# EAGLE board zumo_tb_03 (EAGLE 9.6.2), part 1 of 3
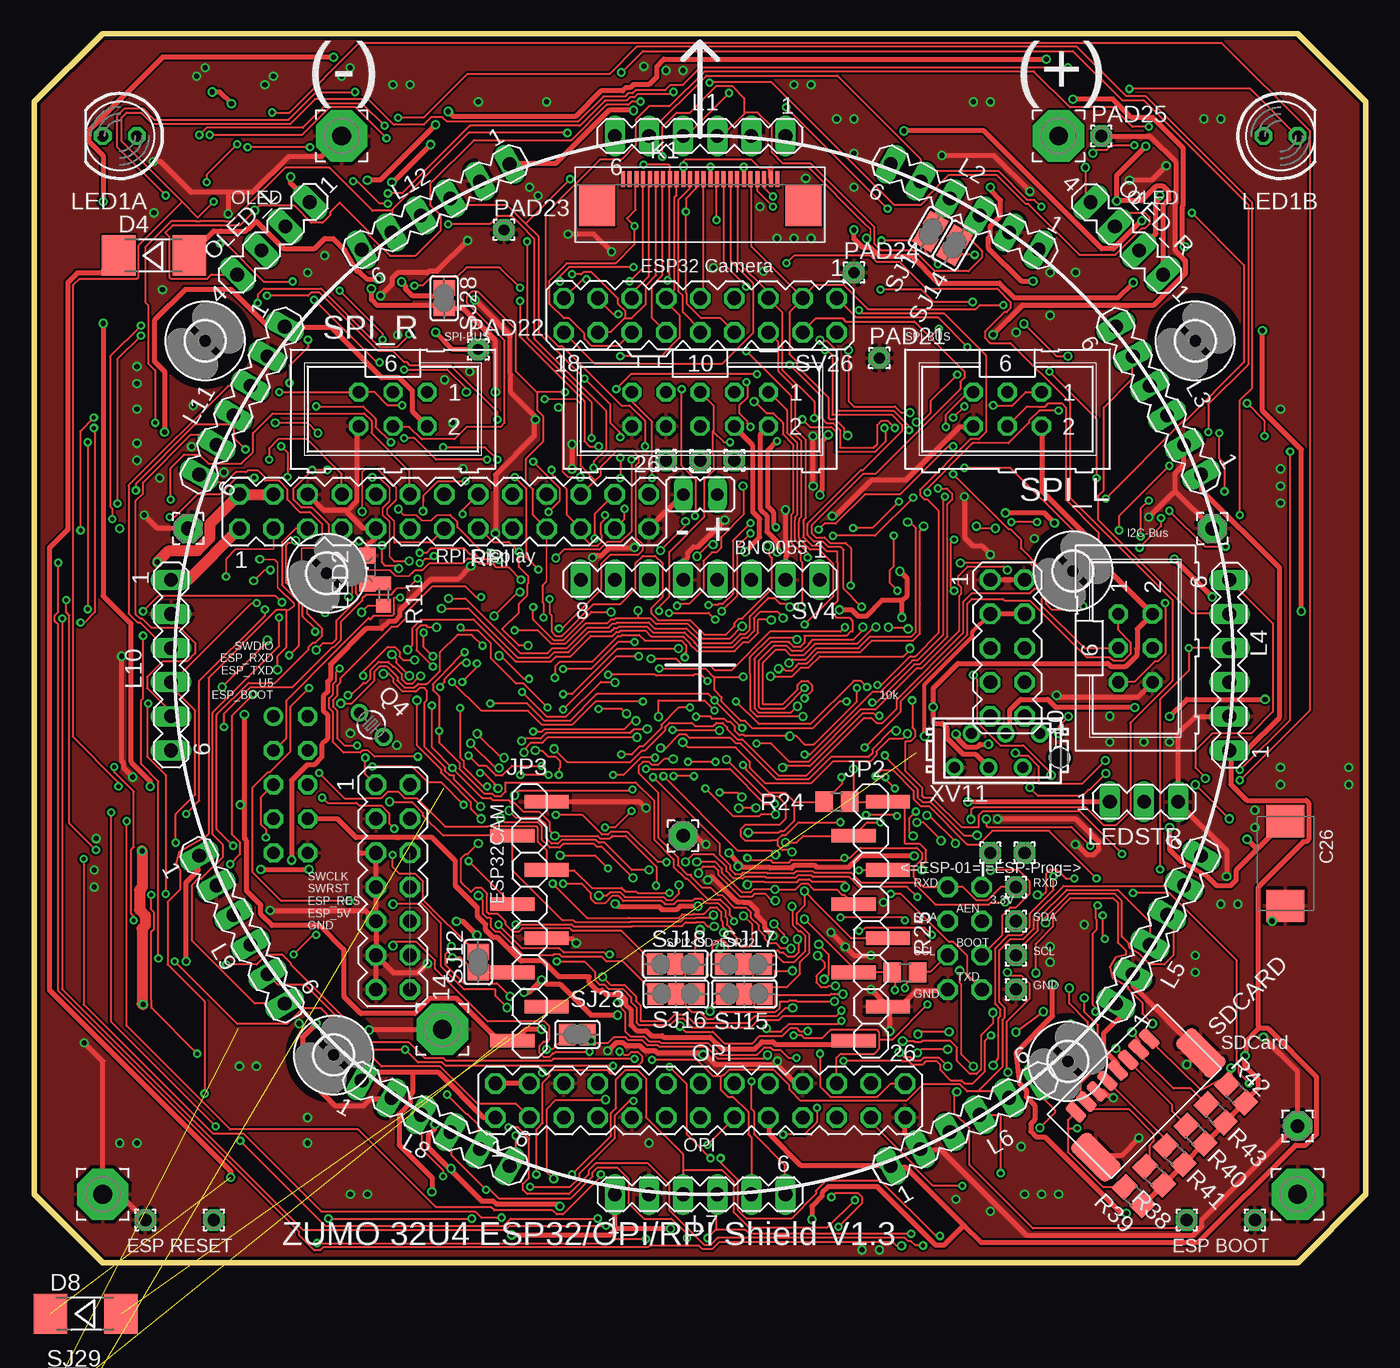
[diagram p2: board, top side]
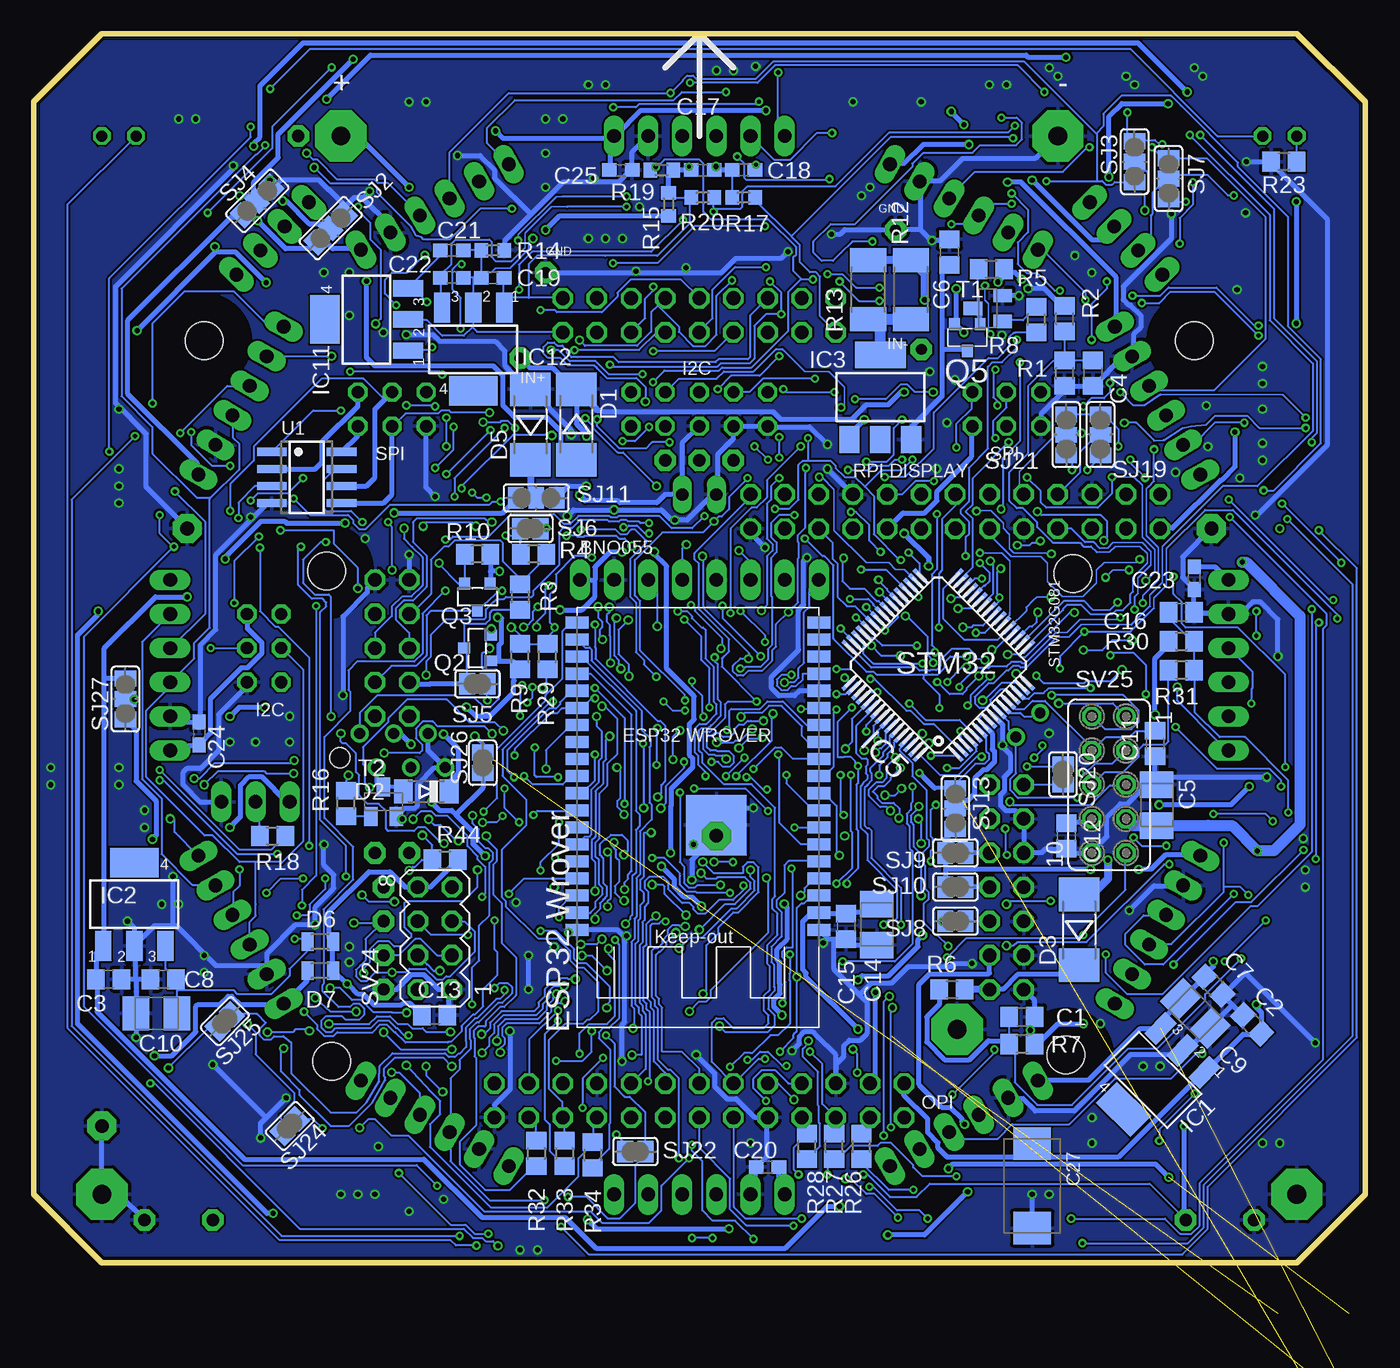
[diagram p3: board, bottom side, seen from below]

Size 99.06 x 91.44 mm. Coordinates in mm from the lower left corner, seen from the top.
Outline: 0,5.08 5.08,0 93.98,0 99.06,5.08 99.06,86.36 93.98,91.44 5.08,91.44 0,86.36 0,5.08
Copper layers (1*16): Top 0.035mm / dielectric 1.5mm / Bottom 0.035mm
Design rules "eagle": minimum track width 5mil, minimum drill 12mil, track to track 6mil, track to pad 6mil, pad to pad 6mil, via to via 6mil, smd to smd 0mil, copper to edge 10mil, drill to drill 10mil, minimum pad ring 10mil, minimum via ring 6mil, stop-mask expansion 2mil, vias tented up to drill 25mil, thermal gap 10mil
Net classes: 1 gnd: width 0.381 mm, drill 0.381 mm; 2 power: width 0.381 mm, drill 0.381 mm
Milling: 8 lines

## Footprints (pad centres in the part's own frame; a part is rotated, then mirrored left to right if it is on the bottom)
3,81/1,4 = drill 1.397 pad 3.81 octagon: 1 0,0
JP1 = drill 0.914 long: 1 0,-1.27; 2 0,1.27
ML6 = drill 0.914 octagon: 1 -2.54,-1.27; 2 -2.54,1.27; 3 0,-1.27; 4 0,1.27; 5 2.54,-1.27; 6 2.54,1.27
ML10 = drill 0.914 octagon: 1 -5.08,-1.27; 2 -5.08,1.27; 3 -2.54,-1.27; 4 -2.54,1.27; 5 0,-1.27; 6 0,1.27; 7 2.54,-1.27; 8 2.54,1.27; 9 5.08,-1.27; 10 5.08,1.27
C0805 = smd 1.3 x 1.5: 1 -0.95,0; 2 0.95,0
B/3528-21R = smd 1.95 x 2.5: + 1.525,0; - -1.525,0
C0603 = smd 1.1 x 1: 1 -0.85,0; 2 0.85,0
SMC_D = smd 2.4 x 2.8: + -3.15,0; - 3.15,0
MELF-MLL41 = smd 2.5 x 3: A 2.625,0; C -2.625,0
MINIMELF = smd 1.4 x 1.8: A 1.7,0; C -1.7,0
MICROMELF-W = smd 0.9 x 1.4: A 0.95,0; C -0.95,0
2,8 = hole 2.8: 0,0
SOT223 = smd 1.219 x 2.235: 1 -2.311,-3.099; 2 0,-3.099; 3 2.311,-3.099 | smd 3.6 x 2.2: 4 0,3.099
SOT223' = smd 1.5 x 2: 1 -2.3,-3.15; 2 0,-3.15; 3 2.3,-3.15 | smd 3.8 x 2: 4 0,3.15
TQFP64 = smd 1.2 x 0.3: 1 -5.7,3.75; 2 -5.7,3.25; 3 -5.7,2.75; 4 -5.7,2.25; 5 -5.7,1.75; 6 -5.7,1.25; 7 -5.7,0.75; 8 -5.7,0.25; 9 -5.7,-0.25; 10 -5.7,-0.75; 11 -5.7,-1.25; 12 -5.7,-1.75; 13 -5.7,-2.25; 14 -5.7,-2.75; 15 -5.7,-3.25; 16 -5.7,-3.75; 33 5.7,-3.75; 34 5.7,-3.25; 35 5.7,-2.75; 36 5.7,-2.25; 37 5.7,-1.75; 38 5.7,-1.25; 39 5.7,-0.75; 40 5.7,-0.25; 41 5.7,0.25; 42 5.7,0.75; 43 5.7,1.25; 44 5.7,1.75; 45 5.7,2.25; 46 5.7,2.75; 47 5.7,3.25; 48 5.7,3.75 | smd 0.3 x 1.2: 17 -3.75,-5.7; 18 -3.25,-5.7; 19 -2.75,-5.7; 20 -2.25,-5.7; 21 -1.75,-5.7; 22 -1.25,-5.7; 23 -0.75,-5.7; 24 -0.25,-5.7; 25 0.25,-5.7; 26 0.75,-5.7; 27 1.25,-5.7; 28 1.75,-5.7; 29 2.25,-5.7; 30 2.75,-5.7; 31 3.25,-5.7; 32 3.75,-5.7; 49 3.75,5.7; 50 3.25,5.7; 51 2.75,5.7; 52 2.25,5.7; 53 1.75,5.7; 54 1.25,5.7; 55 0.75,5.7; 56 0.25,5.7; 57 -0.25,5.7; 58 -0.75,5.7; 59 -1.25,5.7; 60 -1.75,5.7; 61 -2.25,5.7; 62 -2.75,5.7; 63 -3.25,5.7; 64 -3.75,5.7
ESP32-WROVER = smd 1.7 x 0.9: CLK 18,1.27; CMD 0,1.27; EN 0,21.59; GND 0,24.13; GND3 18,24.13; GND_2 0,6.35; IO0 18,7.62; IO2 18,6.35; IO4 18,8.89; IO5 18,12.7; IO12 0,7.62; IO13 0,5.08; IO14 0,8.89; IO15 18,5.08; IO18 18,13.97; IO19 18,15.24; IO21 18,17.78; IO22 18,21.59; IO23 18,22.86; IO25 0,12.7; IO26 0,11.43; IO27 0,10.16; IO32 0,15.24; IO33 0,13.97; IO34 0,17.78; IO35 0,16.51; NC0 18,16.51; NC1 18,10.16; NC2 18,11.43; RXD0 18,19.05; SD0 18,2.54; SD1 18,3.81; SD2 0,3.81; SD3 0,2.54; SENSOR_VN 0,19.05; SENSOR_VP 0,20.32; TXD0 18,20.32; VDD33 0,22.86 | smd 4.5 x 4.5: GND2 7.62,16.34
1X08SMD = smd 1.016 x 3.302: 1 -1.27,1.27; 2 1.27,-1.27; 3 3.81,1.27; 4 6.35,-1.27; 5 8.89,1.27; 6 11.43,-1.27; 7 13.97,1.27; 8 16.51,-1.27
68712414522 = smd 0.3 x 1.2: 1 -5.75,0.6; 2 -5.25,0.6; 3 -4.75,0.6; 4 -4.25,0.6; 5 -3.75,0.6; 6 -3.25,0.6; 7 -2.75,0.6; 8 -2.25,0.6; 9 -1.75,0.6; 10 -1.25,0.6; 11 -0.75,0.6; 12 -0.25,0.6; 13 0.25,0.6; 14 0.75,0.6; 15 1.25,0.6; 16 1.75,0.6; 17 2.25,0.6; 18 2.75,0.6; 19 3.25,0.6; 20 3.75,0.6; 21 4.25,0.6; 22 4.75,0.6; 23 5.25,0.6; 24 5.75,0.6 | smd 2.7 x 3: Z1 -7.68,-1.38; Z2 7.68,-1.38
MA06-1 = drill 1.016 long: 1 -6.35,0; 2 -3.81,0; 3 -1.27,0; 4 1.27,0; 5 3.81,0; 6 6.35,0
LED5MM = drill 0.813 octagon: A -1.27,0; K 1.27,0
CHIPLED_0805 = smd 1.2 x 1.2: A 0,-1.05; C 0,1.05
MA03-1 = drill 1.016 long: 1 -2.54,0; 2 0,0; 3 2.54,0
MA04-1 = drill 1.016 long: 1 -3.81,0; 2 -1.27,0; 3 1.27,0; 4 3.81,0
MA13-2 = drill 1.016 octagon: 1 -15.24,-1.27; 2 -15.24,1.27; 3 -12.7,-1.27; 4 -12.7,1.27; 5 -10.16,-1.27; 6 -10.16,1.27; 7 -7.62,-1.27; 8 -7.62,1.27; 9 -5.08,-1.27; 10 -5.08,1.27; 11 -2.54,-1.27; 12 -2.54,1.27; 13 0,-1.27; 14 0,1.27; 15 2.54,-1.27; 16 2.54,1.27; 17 5.08,-1.27; 18 5.08,1.27; 19 7.62,-1.27; 20 7.62,1.27; 21 10.16,-1.27; 22 10.16,1.27; 23 12.7,-1.27; 24 12.7,1.27; 25 15.24,-1.27; 26 15.24,1.27
1,6/0,9 = drill 0.914 pad 1.6 octagon: 1 0,0
2,15/1,0 = drill 1.016 pad 2.159 octagon: 1 0,0
1,6/0,8 = drill 0.813 pad 1.6 octagon: 1 0,0
SOT23 = smd 0.8 x 0.9: 1 -0.95,-1; 2 0.95,-1; 3 0,1
TC26V = drill 0.813: 1 -1.27,0; 2 1.27,0
MICRO3 = smd 0.8 x 0.9: 1 -0.95,-1; 2 0.95,-1; 3 0,1
R0805 = smd 1.3 x 1.5: 1 -0.95,0; 2 0.95,0
R0603 = smd 1 x 1.1: 1 -0.85,0; 2 0.85,0
R2010 = smd 1.8 x 2.7: 1 -2.2,0; 2 2.2,0
47309-3351 = smd 0.8 x 1.6: 1 4.4,5.66; 2 3.3,5.66; 3 2.2,5.66; 4 1.1,5.66; 5 0,5.66; 6 -1.1,5.66; 7 -2.2,5.66; 8 -3.3,5.66 | smd 1.93 x 3.81: G1 -4.61,2.24; G2 6.393,2.217
SJ = smd 1.168 x 1.6: 1 -0.762,0; 2 0.762,0
SJ_2 = smd 1.168 x 1.6: 1 -1.524,0; 2 0,0; 3 1.524,0
MA07-2 = drill 1.016 octagon: 1 -7.62,-1.27; 2 -7.62,1.27; 3 -5.08,-1.27; 4 -5.08,1.27; 5 -2.54,-1.27; 6 -2.54,1.27; 7 0,-1.27; 8 0,1.27; 9 2.54,-1.27; 10 2.54,1.27; 11 5.08,-1.27; 12 5.08,1.27; 13 7.62,-1.27; 14 7.62,1.27
MA08-1 = drill 1.016 long: 1 -8.89,0; 2 -6.35,0; 3 -3.81,0; 4 -1.27,0; 5 1.27,0; 6 3.81,0; 7 6.35,0; 8 8.89,0
MA05-2 = drill 1.016 octagon: 1 -5.08,-1.27; 2 -5.08,1.27; 3 -2.54,-1.27; 4 -2.54,1.27; 5 0,-1.27; 6 0,1.27; 7 2.54,-1.27; 8 2.54,1.27; 9 5.08,-1.27; 10 5.08,1.27
MA04-2 = drill 1.016 octagon: 1 -3.81,-1.27; 2 -3.81,1.27; 3 -1.27,-1.27; 4 -1.27,1.27; 5 1.27,-1.27; 6 1.27,1.27; 7 3.81,-1.27; 8 3.81,1.27
FE05-2 = drill 0.914: 1 -5.08,1.27 | drill 0.914 octagon: 2 -5.08,-1.27; 3 -2.54,1.27; 4 -2.54,-1.27; 5 0,1.27; 6 0,-1.27; 7 2.54,1.27; 8 2.54,-1.27; 9 5.08,1.27; 10 5.08,-1.27
MA09-2 = drill 1.016 octagon: 1 -10.16,-1.27; 2 -10.16,1.27; 3 -7.62,-1.27; 4 -7.62,1.27; 5 -5.08,-1.27; 6 -5.08,1.27; 7 -2.54,-1.27; 8 -2.54,1.27; 9 0,-1.27; 10 0,1.27; 11 2.54,-1.27; 12 2.54,1.27; 13 5.08,-1.27; 14 5.08,1.27; 15 7.62,-1.27; 16 7.62,1.27; 17 10.16,-1.27; 18 10.16,1.27
SOT23-BEC = smd 1 x 1.4: B -0.95,-1.1; C 0,1.1; E 0.95,-1.1
SO08 = smd 0.6 x 2.2: 1 -1.905,-2.6; 2 -0.635,-2.6; 3 0.635,-2.6; 4 1.905,-2.6; 5 1.905,2.6; 6 0.635,2.6; 7 -0.635,2.6; 8 -1.905,2.6
MICROMATCH-6 = drill 0.813: 1 3.175,1.27; 2 1.905,-1.27; 3 0.635,1.27; 4 -0.635,-1.27; 5 -1.905,1.27; 6 -3.175,-1.27 | hole 1.5: 4.63,-0.55

## Placement (x,y rotation side)
(+)  [3,81/1,4]  76.2,83.82 0 top
(-)  [3,81/1,4]  22.86,83.82 0 top
+-  [JP1]  49.53,57.15 270 top
BUS_6  [ML6]  81.92,45.72 270 top
BUS_10  [ML10]  49.53,63.5 180 top
C1  0.1  [C0805]  25.53,18.29 0 bottom
C2  0.1  [C0805]  8.4,17.73 135 bottom
C3  0.1  [C0805]  93.47,21.08 0 bottom
C4  0.1  [C0805]  20.26,66.17 270 bottom
C5  100uF/6V  [B/3528-21R]  15.49,34.04 270 bottom
C6  0.1  [C0805]  30.92,75.18 90 bottom
C7  0.1  [C0805]  11.28,20.6 315 bottom
C8  0.1  [C0805]  89.41,21.08 180 bottom
C9  100uF/6V  [B/3528-21R]  12.62,18.54 135 bottom
C10  100uF/6V  [B/3528-21R]  89.92,18.54 0 bottom
C11  0.1  [C0805]  15.62,38.61 90 bottom
C12  0.1  [C0805]  22.23,31.75 270 bottom
C13  0.1  [C0805]  69.22,18.41 0 bottom
C14  100uF/6V  [B/3528-21R]  36.32,25.15 90 bottom
C15  0.1  [C0805]  38.61,25.02 270 bottom
C16  0.1  [C0805]  13.65,48.39 180 bottom
C17  [C0603]  49.28,81.28 180 bottom
C18  [C0603]  46.23,81.28 0 bottom
C19  [C0603]  64.9,73.28 180 bottom
C20  [C0603]  44.45,7.11 0 bottom
C21  [C0603]  67.94,75.31 180 bottom
C22  [C0603]  67.94,73.28 0 bottom
C23  [C0603]  12.7,50.93 90 bottom
C24  [C0603]  86.74,39.37 270 bottom
C25  [C0603]  55.37,81.28 180 bottom
C26  470uF/10V  [SMC_D]  93.07,29.69 270 top
C27  470uF/10V  [SMC_D]  24.77,5.71 270 bottom
D1  [MELF-MLL41]  58.67,62.36 270 bottom
D2  [MINIMELF]  69.85,35.05 180 bottom
D3  [MELF-MLL41]  21.27,24.77 90 bottom
D4  [MELF-MLL41]  8.89,74.93 0 top
D5  [MELF-MLL41]  62.1,62.36 90 bottom
D6  [MICROMELF-W]  77.72,23.88 180 bottom
D7  [MICROMELF-W]  77.72,21.72 180 bottom
D8  [MELF-MLL41]  3.81,-3.81 0 top  (outside the outline)
H1  MOUNT-HOLE2.8  [2,8]  86.36,68.58 0 top
H2  MOUNT-HOLE2.8  [2,8]  12.7,68.58 0 top
H3  MOUNT-HOLE2.8  [2,8]  76.88,14.97 0 top
H4  MOUNT-HOLE2.8  [2,8]  22.26,15.45 0 top
H5  MOUNT-HOLE2.8  [2,8]  21.74,51.28 0 top
H6  MOUNT-HOLE2.8  [2,8]  77.27,51.45 0 top
IC1  LT 1963 AEST-3.3 (1.5A)  [SOT223]  15.77,13.6 135 bottom
IC2  MCP1703DB  [SOT223]  91.57,26.67 0 bottom
IC3  LM317MBSTT3  [SOT223']  36.07,64.39 0 bottom
IC5  STM32G081RBT6  [TQFP64]  31.75,44.45 135 bottom
IC10  ESP32-WROVER  [ESP32-WROVER]  40.64,48.9 180 bottom
IC11  MCP1703DB  [SOT223]  74.3,70.17 90 bottom
IC12  MCP1703DB  [SOT223]  66.36,67.94 180 bottom
JP2  [1X08SMD]  62.23,33.02 270 top
JP3  [1X08SMD]  36.83,33.02 270 top
K1  68712414522  [68712414522]  49.53,80.01 0 top
L1  [MA06-1]  49.53,83.82 180 top
L2  [MA06-1]  69.22,78.55 150 top
L3  [MA06-1]  83.63,64.14 120 top
L4  [MA06-1]  88.9,44.45 90 top
L5  [MA06-1]  83.63,24.77 60 top
L6  [MA06-1]  69.22,10.35 30 top
L7  [MA06-1]  49.53,5.08 0 top
L8  [MA06-1]  29.84,10.35 330 top
L9  [MA06-1]  15.43,24.77 300 top
L10  [MA06-1]  10.16,44.45 270 top
L11  [MA06-1]  15.43,64.14 240 top
L12  [MA06-1]  29.84,78.55 210 top
LED1A  [LED5MM]  6.35,83.82 180 top
LED1B  [LED5MM]  92.71,83.82 0 top
LED2  [CHIPLED_0805]  24.77,51.56 0 top
LEDSTR  [MA03-1]  82.55,34.29 0 top
OLED_L  [MA04-1]  17.78,76.2 225 top
OLED_R  [MA04-1]  81.28,76.2 135 top
OPI  [MA13-2]  49.53,12.06 0 top
PAD1  [1,6/0,9]  73.03,27.94 0 top
PAD2  [1,6/0,9]  73.03,25.4 0 top
PAD3  [3,81/1,4]  5.08,5.08 0 top
PAD4  [2,15/1,0]  87.63,54.61 0 top
PAD5  [2,15/1,0]  11.43,54.61 0 top
PAD6  [2,15/1,0]  93.98,10.16 0 top
PAD7  [3,81/1,4]  93.98,5.08 0 top
PAD8  [2,15/1,0]  48.26,31.75 0 top
PAD9  [3,81/1,4]  30.35,17.35 0 top
PAD10  [1,6/0,9]  73.03,22.86 0 top
PAD11  [1,6/0,9]  73.03,20.32 0 top
PAD12  [1,6/0,9]  49.53,59.69 0 top
PAD13  [1,6/0,9]  52.07,59.69 0 top
PAD14  [1,6/0,9]  46.99,59.69 0 top
PAD15  [1,6/0,9]  73.66,30.48 0 top
PAD16  [1,6/0,9]  71.12,30.48 0 top
PAD17  [1,6/0,9]  8.26,3.17 0 top
PAD18  [1,6/0,9]  13.34,3.17 0 top
PAD19  [1,6/0,9]  90.81,3.17 0 top
PAD20  [1,6/0,9]  85.72,3.17 0 top
PAD21  [1,6/0,8]  62.87,67.31 0 top
PAD22  [1,6/0,8]  33.02,67.94 0 top
PAD23  [1,6/0,8]  34.92,76.83 0 top
PAD24  [1,6/0,8]  60.96,73.66 0 top
PAD25  [1,6/0,9]  79.38,83.82 0 top
Q2  BSS138  [SOT23]  66.04,45.72 90 bottom
Q3  BSS138  [SOT23]  66.04,49.53 180 bottom
Q4  [TC26V]  25.07,40.01 135 top
Q5  IRLML5203  [MICRO3]  29.59,68.83 180 bottom
R1  22k  [R0805]  22.35,66.17 90 bottom
R2  100k  [R0805]  22.35,70.23 90 bottom
R3  10k  [R0805]  62.87,49.53 270 bottom
R4  10k  [R0805]  61.85,52.7 180 bottom
R5  100k  [R0805]  27.81,73.91 0 bottom
R6  100k  [R0805]  30.73,20.32 0 bottom
R7  22k  [R0805]  25.53,16.26 180 bottom
R8  10k  [R0805]  24.45,70.17 90 bottom
R9  10k  [R0805]  62.87,45.09 90 bottom
R10  10k  [R0805]  66.04,52.7 180 bottom
R11  [R0603]  25.98,49.71 270 top
R12  10  [R2010]  33.78,72.39 90 bottom
R13  10  [R2010]  36.96,72.39 90 bottom
R14  [R0603]  64.9,75.31 180 bottom
R15  [R0603]  51.82,78.74 90 bottom
R16  1k  [R0805]  75.82,34.16 90 bottom
R17  [R0603]  46.23,79.25 180 bottom
R18  470  [R0805]  81.28,31.75 0 bottom
R19  [R0603]  52.32,81.28 180 bottom
R20  [R0603]  49.28,79.25 0 bottom
R23  68  [R0805]  6.03,81.92 180 bottom
R24  -  [R0805]  59.69,34.29 0 top
R25  100  [R0805]  64.77,21.59 0 top
R26  100  [R0805]  37.47,8.64 90 bottom
R27  100  [R0805]  39.5,8.64 90 bottom
R28  100  [R0805]  41.53,8.64 90 bottom
R29  100  [R0805]  60.83,45.09 90 bottom
R30  100k  [R0805]  13.65,46.23 0 bottom
R31  470  [R0805]  13.65,44.07 180 bottom
R32  0  [R0805]  61.66,8.13 270 bottom
R33  0  [R0805]  59.56,8.13 270 bottom
R34  0  [R0805]  57.47,8 270 bottom
R38  10k  [R0805]  83.31,6.48 135 top
R39  10k  [R0805]  81.79,4.95 135 top
R40  10k  [R0805]  86.39,9.53 135 top
R41  10k  [R0805]  84.84,8 135 top
R42  10k  [R0805]  89.41,12.57 135 top
R43  10k  [R0805]  87.88,11.1 135 top
R44  100k  [R0805]  68.45,29.97 0 bottom
RPI  [MA13-2]  30.48,55.88 0 top
SDCARD  47309-3351  [47309-3351]  83.82,9.53 45 top
SJ1  [SJ]  66.67,76.71 60 top
SJ2  [SJ_2]  76.96,76.96 225 bottom
SJ3  [SJ_2]  17.14,81.92 270 bottom
SJ4  [SJ_2]  82.42,78.99 225 bottom
SJ5  [SJ]  66.04,43.05 180 bottom
SJ6  [SJ]  62.1,54.61 180 bottom
SJ7  [SJ_2]  14.61,80.64 90 bottom
SJ8  [SJ]  30.48,25.4 180 bottom
SJ9  [SJ]  30.48,30.48 180 bottom
SJ10  [SJ]  30.48,27.94 180 bottom
SJ11  [SJ_2]  61.66,56.9 0 bottom
SJ12  [SJ]  33.02,22.35 90 top
SJ13  [SJ_2]  30.48,33.78 270 bottom
SJ14  [SJ]  68.45,75.69 60 top
SJ15  J_RXPTXD  [SJ_2]  52.81,19.99 180 top
SJ16  J_RXPTXD  [SJ_2]  47.73,19.99 0 top
SJ17  J_RXPTXD  [SJ_2]  52.76,22.2 180 top
SJ18  J_RXPTXD  [SJ_2]  47.68,22.2 0 top
SJ19  J_RPITXD  [SJ_2]  19.68,61.59 90 bottom
SJ20  [SJ]  22.48,36.32 270 bottom
SJ21  J_RXPTXD  [SJ_2]  22.23,61.59 90 bottom
SJ22  [SJ]  54.29,8.26 180 bottom
SJ23  [SJ]  40.39,16.97 180 top
SJ24  [SJ]  80.01,10.16 225 bottom
SJ25  [SJ]  84.84,17.96 225 bottom
SJ26  [SJ]  65.63,37.19 90 bottom
SJ27  [SJ_2]  92.23,41.94 90 bottom
SJ28  [SJ]  30.48,71.75 270 top
SJ29  [SJ]  2.54,-8.89 0 top  (outside the outline)
SJ30  [SJ]  2.54,-13.34 0 top  (outside the outline)
SPI_L  [ML6]  72.39,63.5 180 top
SPI_R  [ML6]  26.67,63.5 180 top
SV2  [MA07-2]  26.67,27.94 270 top
SV4  BNO055  [MA08-1]  49.53,50.8 180 top
SV7  [MA05-2]  72.39,45.72 270 top
SV24  [MA04-2]  69.22,24.13 90 bottom
SV25  [FE05-2]  19.05,35.56 270 bottom
SV26  [MA09-2]  49.53,70.48 180 top
T1  [SOT23-BEC]  28.07,70.99 90 bottom
T2  [SOT23-BEC]  73.03,34.29 0 bottom
U1  W25Q40BVSN  [SO08]  78.74,58.42 270 bottom
XV11  MICROMATCH-6  [MICROMATCH-6]  71.63,38.1 0 top

## Tracks (layer width: path | path; a pad name or v marks a point on that pad's centre or on a via)
ADC0
  Bottom 0.127: 19.96,52.86 19.02,52.86 18.59,53.29 16.74,53.29 16.2,52.76 16.2,52.05 17.27,50.98 17.27,49.91
  Bottom 0.152: IC5.17 24.99,45.87 24.99,46.02 22.48,48.54 22.48,48.62 22.15,48.95 21.13,48.95 20.45,48.26 18.8,48.26 18.52,48.54 18.01,48.54 17.45,49.1 17.45,49.73 17.27,49.91 | R1.2 22.4,67.06 23.24,67.06 25.07,65.23 25.07,60.2 26.44,58.83 26.44,56.67 25.91,56.13 25.45,56.13 24.38,55.07 24.38,54.71 23.24,53.57 21.23,53.57 20.95,53.29 20.4,53.29 19.96,52.86 | C4.1 20.27,67.13 22.33,67.13 R1.2 | R2.1 22.33,69.27 22.33,67.21 R1.2
ADC1  (via drill 0.3, 0.35)
  Top 0.127: v18.41,49.12 17.93,49.61 17.9,49.61
  Top 0.152: v8.08,48.46 9.22,49.61 17.9,49.61 | v8.08,46.63 8.08,41.99 7.92,41.83 7.92,37.11 9.22,35.81 v9.22,22.63
  Bottom 0.127: 20.93,49.25 20.24,48.56 18.97,48.56 v18.41,49.12
  Bottom 0.152: v8.08,46.63 v8.08,48.46 | v9.22,22.63 11.89,19.96 11.89,19.51 15.47,15.93 17.6,15.93 21.79,11.73 24.38,11.73 26.06,13.41 26.06,15.85 26.44,16.23 R7.2 26.44,16.31 26.44,16.51 26.44,18.29 C1.1 | IC5.18 25.38,46.25 22.38,49.25 20.93,49.25 | R6.1 31.67,20.27
  Bottom 0.381: 31.67,20.27 31.67,19.21 32.6,18.28 32.6,16.42 31.28,15.1 29.42,15.1 28.01,16.51 26.44,16.51
BNO055_RESET  (via drill 0.3, 0.35)
  Top 0.152: v36.27,42.44 38.1,40.62 39.55,40.62 42.14,43.2 43.16,43.2 v43.2,43.16
  Bottom 0.152: v36.27,42.44 36.96,42.44 37.34,42.06 IC5.52 | v43.2,43.16 43.16,43.2 42.45,43.2 42.14,43.52 42.14,44.22 41.73,44.63 41.73,48.4 41.35,48.78 41.35,50.09 SV4.8
BUS_FON  (via drill 0.35)
  Top 0.127: v40.62,58.45 39.7,58.45 39.29,58.85 39.29,63.32 v38.99,63.63
  Bottom 0.127: IC5.34 34.27,51.56 34.92,51.56 35.43,52.07 37.08,52.07 39.5,54.48 39.5,57.53 40.41,58.45 v40.62,58.45 | v38.99,63.63 38.73,63.88 38.73,65.15 39.88,66.29 41.68,66.29
  Bottom 0.152: 41.68,66.29 43.36,67.97 43.81,67.97 45.49,66.29 47.7,66.29 48.23,65.76 51.05,65.76 52.05,64.77 BUS_10.3 | IC5.34 33.45,50.75
BUS_RESET  (via drill 0.3, 0.38)
  Top 0.152: v39.32,44.17 41.43,44.17 43.43,46.18 v44.65,46.18 | v46.46,48.49 46.46,48.77 47.24,49.55 47.24,52.88 49.86,55.5 49.86,58.25 50.56,58.95 50.56,60.12 50.48,60.19 50.48,61.84 | 50.48,61.84 50.52,61.87 50.52,63.78 BUS_10.5 | v84.12,49.07 84.12,45.26 83.59,44.73 83.36,44.73 81.84,43.2 80.7,43.2 BUS_6.5 | v82.3,54.03 82.3,56.08 v82.91,56.69 | v79.02,58.37 79.02,62.79 v75.51,66.29 | v51.74,61.04 51.28,61.04 50.48,61.84 | v63.25,62.1 63.35,62 63.35,61.11 62.56,60.33 59.69,60.33 59.63,60.39 59.63,61.83 59.29,62.17 57.7,62.17 v57.12,62.74 | v68.66,66.06 66.67,64.08 66.67,63.22 66,62.54 v65.62,62.54
  Bottom 0.152: v39.32,44.17 38.23,44.17 38.22,44.12 37.26,43.16 37.26,42.98 37.72,42.52 IC5.51 | v46.46,48.49 44.65,46.69 v44.65,46.18 | v84.12,49.07 84.12,52.2 v82.3,54.03 | v82.91,56.69 82.37,57.23 80.16,57.23 v79.02,58.37 | v75.51,66.29 68.89,66.29 v68.66,66.06 | v57.12,62.74 57.12,62.23 55.47,60.58 53.49,60.58 53.03,61.04 v51.74,61.04 | v65.62,62.54 64.33,62.54 64.23,62.64 63.78,62.64 v63.25,62.1
CAM_D0  (via drill 0.3, 0.38)
  Top 0.127: 26.26,68.12 26.98,68.12 | v36.12,72.54 34.62,74.04
  Top 0.15: 26.98,68.12 27.86,69 v27.86,69.09
  Top 0.152: 43.97,70.26 43.89,70.26 42.9,69.27 41.91,69.27 SV26.16 | 43.97,70.26 44.42,70.26 45.49,71.32 45.49,72.69 46.25,73.46 46.25,80.54 K1.6 | v62.56,36.2 63.02,36.65 63.86,36.65 65.41,35.1 65.41,34.49 65.92,33.97 66.53,33.97 69.39,31.12 70.27,31.12 71.27,32.12 75.48,32.12 v79.02,28.57 | v81.74,27.51 84.43,27.51 89.46,22.48 89.46,14.85 89.6,14.71 89.6,14.11 v90.37,13.34 | v6.17,56.46 6.17,67.21 v7.92,68.96 | v16.61,71.4 16.61,72.01 17.07,72.47 21.34,72.47 25.69,68.12 26.26,68.12 | v40.01,73.53 40.69,73.53 40.84,73.69 41.45,73.69 43.43,71.7 43.43,71.32 43.97,70.79 43.97,70.26 | 34.62,74.04 32.13,74.04 31.42,73.33 29.52,73.33 28.88,72.69 v28.27,72.69 | v1.78,52.07 1.78,48.41 1.52,48.15 1.52,47.71 1.75,47.48 1.75,20.22 19.68,2.29 19.68,2.03 20.7,1.02 20.71,1.02 20.81,0.91 21.25,0.91 21.48,1.14 45.64,1.14 45.74,1.25 49.45,1.25 49.71,0.99 50.41,0.99 50.94,1.52 63.88,1.52 64.15,1.26 v64.52,1.26
  Bottom 0.127: v28.27,72.69 28.27,71.6 28.02,71.36 28.02,69.25 v27.86,69.09
  Bottom 0.152: v81.74,27.51 80.67,28.57 v79.02,28.57 | v90.37,13.34 90.07,13.34 79.25,2.52 67.06,2.52 66.37,1.83 65.68,1.83 65.45,1.6 64.86,1.6 v64.52,1.26 | v6.17,56.46 v1.78,52.07 | v7.92,68.96 11.2,72.24 14.48,72.24 15.32,71.4 v16.61,71.4 | v36.12,72.54 37.87,72.54 38.86,73.53 v40.01,73.53 | IC10.IO5 59.05,36.2 59.69,35.56 61.92,35.56 v62.56,36.2
CAM_D1  (via drill 0.3)
  Top 0.152: v44.27,73 45.26,73.99 45.26,80.54 K1.4 | v43.43,70.56 43.05,70.56 41.91,71.7 SV26.15 | v57.3,37.8 57.68,37.8 62.33,42.44 62.94,42.44 65.3,44.81 65.68,44.81 67.59,46.71 67.59,56.84 v67.74,57 | 63.48,62.64 63.69,62.42 | 63.69,62.42 v64.01,62.1 | v56.19,66.8 58.55,64.44 58.55,62.87 58.94,62.47 59.42,62.47 59.93,61.96 59.93,60.63 62.44,60.63 62.71,60.91 62.71,62.32 63.02,62.64 63.47,62.64 63.68,62.42 63.69,62.42
  Bottom 0.152: v44.27,73 43.43,72.16 v43.43,70.56 44.58,70.56 45.44,69.7 45.44,67.26 45.8,66.9 47.95,66.9 48.18,66.67 56.06,66.67 v56.19,66.8 | v57.3,37.8 57.3,35.89 58.22,34.98 58.6,34.98 IC10.IO18 | v67.74,57 67.74,58.37 v64.01,62.1
CAM_D2  (via drill 0.3, 0.38)
  Top 0.15: 64.47,74.37 64.39,74.45 62.67,74.45 62.21,74.91 56.49,74.91 v55.96,74.37 | 40.77,74.37 43.26,74.37 44.65,75.77 v44.65,77.11
  Top 0.152: 40.77,74.37 39.62,74.37 38.33,73.08 38.33,71.32 39.4,70.26 39.78,70.26 40.92,69.11 40.92,68.73 41.45,68.2 43.43,68.2 SV26.14 | K1.3 44.73,80.54 44.73,78.33 44.08,77.69 v44.65,77.11 | v61.87,33.3 64.08,33.3 v64.16,33.22 | 64.47,74.37 66.37,72.47 71.63,72.47 72.62,71.48 72.62,71.02 72.31,70.71 72.16,70.71 70.71,69.27 70.71,68.81 71.09,68.43 72.62,68.43 77.04,64.01 77.04,56.92 84.66,49.3 84.66,43.28 81.53,40.16 81.53,33.6 80.47,32.54 79.55,32.54 78.22,33.87 69.88,33.87 69.67,33.66 v69.67,32.98 | v67.45,31.39 67.45,31.43 66.14,32.75 v65.66,32.75
  Bottom 0.15: v44.65,77.11 49.89,77.11 52.63,74.37 v55.96,74.37
  Bottom 0.152: v61.87,33.3 61.57,33.6 58.67,33.6 IC10.IO19 | v69.67,32.98 69.26,32.57 68.79,32.57 67.62,31.39 v67.45,31.39 | v65.66,32.75 64.63,32.75 v64.16,33.22
CAM_D3  (via drill 0.38)
  Top 0.152: K1.5 45.72,80.54 45.72,73.38 44.5,72.16 44.5,71.78 SV26.13 | v57.17,40.63 53.76,40.63 53.26,41.12 53.26,43.81 53.25,43.82 53.25,45.05 54.69,46.48 56.79,46.48 56.73,46.42 v56.73,46.37 | v57.06,48.8 57.1,48.84 57.1,52.13 57,52.23 57,52.89 56.3,53.59 56.3,53.67 56.29,53.68 56.29,55.39 56.3,55.4 56.3,55.62 56.45,55.77 56.45,60.85 55.68,61.63 55.68,62.49 55,63.17 54.5,63.17 53.62,64.06 v53.54,64.06
  Bottom 0.15: 59.69,68.2 59.72,68.23 60.1,68.23 60.33,68.45 60.8,68.45 61.13,68.12 61.13,67.64 60.8,67.31 59.85,67.31 59.3,66.75 57.36,66.75 57.15,66.55
  Bottom 0.152: IC10.IO21 58.05,31.71 57.7,31.71 57.56,31.84 57.56,35.2 57,35.76 57,37.35 56.77,37.57 56.77,39.52 57.17,39.93 v57.17,40.63 | SV26.13 45.74,70.46 45.74,67.39 45.92,67.21 48.08,67.21 48.31,66.98 55.52,66.98 55.93,67.39 58.58,67.39 58.6,67.36 59.05,67.36 59.36,67.67 59.36,67.87 59.69,68.2 | 57.15,66.55 56.41,65.81 54.2,65.81 53.54,65.15 v53.54,64.06 | v57.06,48.8 57.06,47.99 56.77,47.69 56.77,47.25 56.95,47.07 56.95,46.46 56.86,46.37 v56.73,46.37
CAM_D4  (via drill 0.3, 0.38)
  Top 0.152: SV26.12 45.95,70.26 45.95,72.69 46.71,73.46 46.71,80.54 K1.7 | v57.3,47.47 59.44,49.61 59.44,51.97 58.37,53.03 57.71,53.03 56.91,53.84 56.91,53.92 56.9,53.93 56.9,55.13 56.91,55.15 56.91,55.37 57.06,55.52 57.06,61.1 56.29,61.88 56.29,64.49 v52.96,67.82 | v50.98,34.98 52.35,34.98 52.63,34.7 v52.63,34.65 | v41.98,27.3 42.58,27.3 42.84,27.57 43.57,27.57 43.94,27.2 46.79,27.2 47.02,26.98 47.47,26.98 47.95,27.46 v47.95,28.09
  Bottom 0.152: 40.72,28.57 IC10.SENSOR_VP 40.99,28.57 41.72,27.85 41.72,27.57 v41.98,27.3 | v50.98,34.98 50.98,29.79 50.67,29.49 50.67,28.91 50.66,28.9 50.66,28.24 50.33,27.9 49.85,27.9 49.66,28.09 v47.95,28.09 | v52.96,67.82 48.39,67.82 SV26.12 | v57.3,47.47 57.3,45.8 57.25,45.75 57.25,44.93 52.63,40.31 52.43,40.31 52.07,39.95 52.07,35.82 52.35,35.54 52.35,34.92 v52.63,34.65
CAM_D5  (via drill 0.3, 0.38)
  Top 0.152: K1.9 47.78,80.54 47.78,79.4 47.62,79.25 47.62,72.39 SV26.11 47.02,71.7 47.02,71.48 48.01,70.48 48.01,68.81 46.63,67.44 v43.59,67.44 | v49.15,55.55 49.15,55.93 49.23,56.01 49.23,58.23 48.16,59.29 v48.16,65 | v68.43,49.99 68.2,50.22 68.2,53.57 v68.43,53.8 | v48.03,17.6 48.45,17.18 50.47,17.18 51.34,16.31 53.4,16.31 53.95,16.85 55.65,16.85 56.24,17.45 56.69,17.45 56.91,17.22 v57.53,17.22 | v60.2,15.01 64.54,15.01 64.59,14.96 65.08,14.96 65.32,14.72 66.05,14.72 66.29,14.96 67.16,14.96 67.37,14.74 67.37,14.37 68.17,13.58 68.98,13.58 69.22,13.34 69.82,13.34 70.73,14.24 70.73,16.48 v71.17,16.93 v71.17,16.92
  Bottom 0.152: v57.53,17.22 57.53,15.7 58.22,15.01 v60.2,15.01 | v71.17,16.92 71.48,16.92 72.01,17.45 72.09,17.45 72.66,18.02 73.39,18.02 73.96,17.45 76.59,17.45 76.85,17.18 77.33,17.18 77.66,17.52 77.66,17.99 77.33,18.33 76.11,18.33 75.84,18.06 74.86,18.06 74.49,18.43 74.49,18.91 74.82,19.24 75.29,19.24 75.53,19.01 76.38,19.01 77.56,20.18 77.56,20.66 77.5,20.72 77.5,26.29 75.29,28.5 75.29,30.94 77.42,33.07 77.42,39.12 75.48,41.06 75.48,42.45 75.63,42.6 75.63,44.07 74.99,44.7 70.73,44.7 70.13,45.31 70.13,48.28 v68.43,49.99 | v49.15,55.55 50.06,54.63 51.59,54.63 52.5,55.55 55.53,55.55 55.64,55.44 56.12,55.44 56.23,55.55 58.52,55.55 59.13,54.94 59.59,54.94 60.35,55.7 63.55,55.7 65.23,54.03 67.87,54.03 68.1,53.8 v68.43,53.8 | v48.16,65 47.17,65.99 45.03,65.99 v43.59,67.44 | IC10.SENSOR_VN 40.69,29.87 42.89,29.87 43.2,29.56 43.2,27.5 43.78,26.93 43.78,26.46 43.41,26.09 43.41,24.27 44.17,23.5 44.17,22.37 43.98,22.18 43.98,20.55 43.94,20.51 43.94,20.2 44.4,19.75 44.4,18.86 43.95,18.42 43.95,17.64 44.45,17.14 47.57,17.14 v48.03,17.6
CAM_D6  (via drill 0.3)
  Top 0.152: SV26.10 49.53,69.42 48.23,70.71 48.23,71.93 47.93,72.24 47.93,79.1 48.77,79.93 48.77,80.54 K1.11 | v43.66,37.8 44.42,37.8 45.03,38.41 45.26,38.41 46.63,39.78 46.63,40.01 47.93,41.3 v48.77,41.3 | v41.99,60.73 41.3,60.73 40.92,61.11 40.92,64.08 36.12,68.89 v36.12,71.55 | v39.09,73 39.09,73.38 39.78,74.07 v44.58,74.07 | v47.22,48.34 50.16,48.34 v50.65,47.85
  Bottom 0.152: v43.66,37.8 43.59,37.72 43.59,32.77 41.99,31.17 40.69,31.17 IC10.IO34 | v47.22,48.34 47.19,48.36 47.19,54.61 45.64,56.16 45.26,56.16 44.5,56.92 44.5,58.22 v41.99,60.73 | v36.12,71.55 37.64,71.55 v39.09,73 | v44.58,74.07 46.86,74.07 48.54,72.39 48.54,70.26 49.53,69.27 SV26.10 | v50.65,47.85 49.38,46.58 49.38,44.83 48.77,44.22 v48.77,41.3
CAM_D7  (via drill 0.3, 0.38)
  Top 0.152: K1.13 49.76,80.54 49.76,72.01 49.53,71.78 SV26.9 | v42.44,32.38 43.2,32.38 v44.42,33.6 | v62.71,42.98 63.02,42.98 65.15,45.11 65.53,45.11 67.28,46.86 67.28,55.93 66.45,56.77 66.22,56.77 65.91,57.08 65.91,57.53 69.65,61.27 70.26,61.27 70.79,61.8 70.79,67.51 67.67,70.64 61.57,70.64 v61.34,70.87 | v55.13,33.34 55.09,33.38 54.1,33.38 53.96,33.24 51.96,33.24 v49.91,35.28 | v55.66,36.83 55.68,36.84 55.68,36.93 57.68,36.93 61.59,40.84 62.46,40.84 62.61,40.69 v62.87,40.69
  Bottom 0.152: v42.44,32.38 IC10.IO35 | v44.42,33.6 46.1,35.28 v49.91,35.28 | v62.87,40.69 62.87,42.82 v62.71,42.98 | v61.34,70.87 60.27,70.87 60.12,70.71 56.77,70.71 55.63,71.86 55.63,72.16 54.63,73.15 50.9,73.15 49.53,71.78 SV26.9 | v55.13,33.34 55.13,33.42 55.63,33.92 55.63,34.36 55.4,34.59 55.4,36.83 55.52,36.96 55.65,36.96 55.66,36.94 v55.66,36.83
CAM_GND  (via drill 0.38)
  Top 0.127: 61.65,77.42 62.19,76.87 62.19,76.2 v61.91,76.2
  Top 0.152: K1.10 v48.28,81.56 | v48.28,81.56 48.28,81.89 48.26,81.92 | 48.26,81.92 48.26,81.58 v48.28,81.56 | K1.23 54.66,80.73 54.66,81.31 | 54.66,81.31 54.52,81.44 53.97,81.44 53.34,82.07 48.41,82.07 48.26,81.92 | 61.65,77.42 57.61,81.46 55.02,81.46 54.86,81.31 54.71,81.31 54.66,81.31
  Bottom 0.127: v61.91,76.2 62.22,75.89 62.22,75.39 63.61,74 64.69,74 65.02,73.66 65.76,73.66
  Bottom 0.152: R17.2 47.09,79.25 47.09,81.15 C18.1 | C17.1 48.23,81.46 48.23,81.53 v48.28,81.56 | 66.37,73.3 67.06,73.3 C22.2 | 66.37,73.3 65.76,73.3 C19.2 65.76,73.38 65.76,73.66 65.76,75.29 R14.2 65.76,75.36 67.06,75.36 C21.1 | 66.37,73.3 66.37,71.09 IC12.2 66.37,71.02 66.37,69.65 66.41,69.61 | 66.41,69.61 67.06,68.96 68.66,68.96 69.8,70.1 71.17,70.1 IC11.2 | 66.41,69.61 66.06,69.27 59.74,69.27 SV26.2
  Bottom 0.381: C18.1 C17.1
CAM_HSYNC  (via drill 0.3, 0.38)
  Top 0.152: v52.96,72.62 51.28,74.3 51.28,80.54 K1.16 | SV26.6 55.32,68.5 55.32,66.32 56.59,65.05 56.59,62.01 57.37,61.23 57.37,55.39 57.21,55.24 57.21,55.02 57.2,55.01 57.2,54.06 57.21,54.05 57.21,53.96 57.84,53.34 58.53,53.34 58.94,52.93 59.69,52.93 59.69,52.15 59.74,52.09 59.74,49.22 59.32,48.8 59.32,48.33 59.66,47.99 60.62,47.99 60.86,47.75 60.86,46.94 60.72,46.94 60.42,46.63 57.27,46.63 57.3,46.6 57.3,46.13 56.97,45.8 56.49,45.8 56.16,46.13 56.16,46.18 54.81,46.18 53.57,44.93 53.57,41.25 53.88,40.93 56.3,40.93 v56.76,41.4
  Bottom 0.152: v52.96,72.62 52.96,72.31 53.57,71.7 53.57,70.26 SV26.6 | IC10.IO23 57.62,26.04 57.6,26.06 57.6,26.08 57.23,26.44 57.23,26.89 56.72,27.4 56.72,27.87 56.99,28.14 56.99,29.94 57.24,30.19 57.24,31.27 57,31.52 57,31.54 56.95,31.59 56.95,34.92 56.36,35.51 56.36,37.12 55.63,37.85 55.63,40.44 56.67,41.48 56.68,41.48 v56.76,41.4
CAM_PCLK  (via drill 0.3, 0.38)
  Top 0.127: 75.81,49.8 75.81,50.53 74.85,51.49 74.85,51.69 73.38,53.16
  Top 0.152: v45.31,81.69 47.19,81.69 47.28,81.6 K1.8 47.24,80.54 47.24,73.23 v47.09,73.08 | v59.97,25.68 64.54,25.68 v64.77,25.45 | v78.94,18.67 78.94,18.97 78.72,19.2 78.72,24.46 79.02,24.77 79.02,25.53 78.94,25.6 78.94,26.42 v79.1,26.57 | v68.35,58.67 72.47,54.56 72.62,54.56 73.38,53.8 73.38,53.16 | v65.08,61.95 65.08,62.23 65.07,62.23 63.91,63.39 59.69,63.39 59.69,67.81 58.92,68.58 58.45,68.58 v58.45,68.63 | 75.81,49.8 75.23,49.23 75.23,49.02 75.65,48.6 77.79,48.6 v78.03,48.84
  Bottom 0.152: C18.2 45.42,81.32 45.42,81.58 v45.31,81.69 | v59.97,25.68 59.97,26.36 59.05,27.28 58.67,27.28 IC10.IO22 | v64.77,25.45 64.77,23.32 64.54,23.09 64.54,21.41 65.61,20.34 65.61,19.07 66.19,18.48 66.35,18.48 67.22,17.61 67.22,17.19 67.96,16.45 68.18,16.45 68.25,16.38 71.4,16.38 72.16,17.14 72.22,17.14 72.79,17.72 73.26,17.72 73.83,17.14 76.46,17.14 76.73,16.88 77.45,16.88 77.97,17.39 77.97,17.69 v78.94,18.67 | v79.1,26.57 79.1,27.74 78.03,28.8 v78.03,48.84 | v65.08,61.95 v68.35,58.67 | SV26.7 52.62,71.21 | 52.62,71.21 53.11,70.71 53.11,69.27 54.15,68.22 58.04,68.22 v58.45,68.63 | v47.09,73.08 48.23,71.93 48.23,69.04 49.07,68.2 49.99,68.2 51.05,69.27 51.05,69.65 52.62,71.21
CAM_PWDN  (via drill 0.3)
  Top 0.152: v13.03,83.9 19.89,83.9 21.95,85.95 23.9,85.95 v26.19,83.67 | SV26.18 41.68,66.9 51.21,66.9 53.49,69.19 53.49,72.85 51.82,74.52 51.82,80.54 K1.17
  Bottom 0.127: 16,48.84 16,49.66 15.06,50.6 15.06,53.29 | 17.37,47.47 21.11,47.47 22.03,46.55 22.92,46.55
  Bottom 0.15: 40.54,70.41 40.54,73.37 40.85,73.68 41.3,73.68 42.05,74.44 42.05,75.7 42.69,76.34 42.69,76.36
  Bottom 0.152: 40.54,70.41 39.4,69.27 SV26.18 | R17.1 45.34,79.25 45.34,79.02 42.69,76.36 35.28,83.77 26.29,83.77 v26.19,83.67 | 16,48.84 17.37,47.47 | 15.06,53.29 10.59,57.76 8,57.76 3.89,61.87 3.89,66.9 7.09,70.1 7.09,77.95 v13.03,83.9 | 22.92,46.55 25.2,44.27 25.61,44.27 25.72,44.39 26.2,44.39 26.54,44.04 26.7,44.04 27.65,43.09 28.03,43.09 29.03,42.09 29.02,42.08 29.02,41.6 28.68,41.26 28.21,41.26 27.88,41.6 27.88,41.87 27.13,42.62 26.74,42.62 IC5.13
CAM_RESET  (via drill 0.3)
  Top 0.152: v52.77,81.52 v52.78,81.51 K1.19 | v41.07,73.15 40.77,73.15 SV26.17 | v43.05,36.27 43.81,36.27 45.11,37.57 v46.18,37.57 | v49.07,36.2 v47.55,36.2 | v51.13,48.46 52.27,49.61 52.27,53.26 v53.26,54.25 | v52.98,65.51 53.03,65.46 53.03,64.36 52.43,63.75 52.43,63.2 53.01,62.62 53.01,62.43 v53.26,62.18
  Top 0.381: v55.17,54.71 55.02,54.86 55.02,55.79 54.55,56.25 54.55,60.42 v55.24,61.11
  Bottom 0.15: 44.42,77.65 42.36,75.58 42.36,74.97 42.55,74.78 42.55,73.79 41.91,73.15
  Bottom 0.152: v52.77,81.52 52.83,81.58 52.83,81.62 R19.2 52.73,81.72 52.73,81.76 52.43,81.76 52.12,82.07 49.53,82.07 49.23,81.76 49.23,78.18 48.69,77.65 44.42,77.65 | v43.05,36.27 43.05,35.66 41.07,33.68 40.69,33.68 IC10.IO32 | v47.55,36.2 v46.18,37.57 | v49.07,36.2 49.07,36.5 49.61,37.03 49.61,37.7 49.86,37.96 49.86,39.72 49.5,40.08 49,40.08 48.24,40.84 48.23,40.84 48.23,41.53 48.46,41.76 48.46,44.35 49.07,44.96 49.07,47.09 49.24,47.26 49.38,47.26 50.08,47.95 50.08,48.09 50.44,48.46 v51.13,48.46 | v55.24,61.11 54.33,61.11 v53.26,62.18 | v52.98,65.51 52.12,66.37 48.06,66.37 47.83,66.6 45.64,66.6 42.9,69.34 42.9,72.24 41.99,73.15 41.91,73.15 v41.07,73.15 | v53.26,54.25 53.59,54.25 54.17,54.84 54.76,54.84 54.89,54.71 v55.17,54.71
CAM_SCL  (via drill 0.3, 0.38)
  Top 0.152: K1.20 53.34,80.54 53.34,75.59 57.15,71.78 SV26.3 | v69.95,74.98 68.12,74.98 SJ14.1 | v72.08,71.25 70.33,71.25 70.03,70.94 62.03,70.94 60.2,72.77 58.06,72.77 57.15,71.86 SV26.3 | v50.6,41.07 49.84,41.83 46.43,41.83 v46.43,40.62 | v61.95,42.82 61.49,43.28 60.96,43.28 57.73,40.06 53.9,40.06 v52.2,41.76 | v62.33,41.68 62.64,41.68 65.46,44.5 65.84,44.5 67.89,46.56 67.89,56.39 68.28,56.77 68.28,57.23 67.89,57.61 v67.21,57.61 | SV26.3 57.15,71.7 56.16,70.71 56.16,67.58 56.72,67.02 56.72,66.7 59.05,64.36 59.05,62.87 59.14,62.78 59.54,62.78 60.24,62.08 60.24,61.81 v60.5,61.54
  Bottom 0.152: v72.08,71.25 72.92,72.08 72.92,73.13 72.39,73.66 71.27,73.66 v69.95,74.98 | v50.6,41.07 51.51,41.07 v52.2,41.76 | v61.95,42.82 61.95,42.06 v62.33,41.68 | v67.21,57.61 67.21,57.76 63.4,61.57 60.53,61.57 v60.5,61.54 | v46.43,40.62 46.15,40.89 44.88,40.89 44.35,41.43 43.41,41.43 41.88,39.9 41.88,39.17 41.45,38.73 IC10.IO27
CAM_SDA  (via drill 0.3, 0.38)
  Top 0.152: v54.94,79.32 54.33,79.93 54.33,80.54 K1.22 | SJ1.1 v63.02,76.05 | 66.64,68.85 65.46,70.03 60.35,70.03 60.12,70.26 58.14,70.26 57.15,69.27 SV26.4 | 66.64,68.85 69.19,66.29 69.19,65.84 68.89,65.53 68.89,65 62.56,58.67 61.65,58.67 57.82,54.85 57.82,54.77 57.81,54.76 57.81,54.31 57.82,54.3 57.82,54.27 58.14,53.95 58.78,53.95 59.19,53.54 60.35,53.54 60.73,53.16 v60.73,50.37 | SJ1.1 66.29,75.21 v67.21,74.3 | 66.64,68.85 v67.28,69.49 | SJ1.1 | v61.63,47.28 61.63,47.08 60.88,46.33 57.86,46.33 57.61,46.08 57.61,46.01 57.09,45.49 56.37,45.49 55.99,45.87 54.99,45.87 53.87,44.76 53.87,41.37 54.01,41.24 55.79,41.24 v57.3,42.75 | v45.49,36.73 51.74,36.73 54.33,34.14 v55.09,34.14
  Bottom 0.127: 59.74,79.32 60.16,79.32 63.02,76.46 v63.02,76.05
  Bottom 0.152: v54.94,79.32 59.74,79.32 | v45.49,36.73 43.89,38.33 43.43,38.33 42.6,37.49 40.69,37.49 IC10.IO26 | v55.09,34.14 55.09,40.54 v57.3,42.75 | v67.21,74.3 67.51,74.3 67.89,73.91 67.89,72.39 67.28,71.78 v67.28,69.49 | v60.73,50.37 61.01,50.09 61.01,48.28 61.65,47.65 61.65,47.3 v61.63,47.28
CAM_U1.2  (via drill 0.3)
  Top 0.152: v50.75,77.57 50.75,80.54 K1.15 | v62.94,72.39 65.99,72.39 66.9,71.48 v69.8,71.48
  Bottom 0.127: 60.12,75.21 60.17,75.21 | 62.94,73.58 v62.94,72.39
  Bottom 0.15: 60.17,75.21 61.99,75.21 62.94,74.25 62.94,73.58
  Bottom 0.152: 71.02,72.69 71.17,72.54 IC11.3 71.02,72.69 | 71.02,72.69 68.81,74.91 68.81,75.29 C21.2 | v50.75,77.57 53.11,75.21 60.12,75.21 | 71.02,72.69 v69.8,71.48
CAM_U2.8  (via drill 0.3)
  Top 0.152: v54.94,78.56 53.8,79.7 53.8,80.54 K1.21
  Bottom 0.127: 59.36,78.56 60.52,78.56 62.5,76.59 62.5,75.51 63.46,74.55 63.48,74.55 63.5,74.52
  Bottom 0.152: IC12.3 68.73,71.09 68.73,73.23 C22.1 68.73,73.3 68.73,73.53 67.97,74.3 67.97,75.82 67.67,76.12 65.15,76.12 65,75.97 65,74.83 64.69,74.52 63.5,74.52 | v54.94,78.56 59.36,78.56
CAM_U3.3  (via drill 0.3)
  Top 0.152: v50.3,81.53 50.3,80.64 K1.14 | v69.42,68.12 67.21,70.33 61.11,70.33 SV26.1
  Bottom 0.15: 56.54,74.91 61.62,74.91 62.23,74.3 62.23,71.78
  Bottom 0.152: v50.3,81.53 50.3,81.46 C17.2 | 64.08,71.78 64.08,71.09 IC12.1 64.08,71.78 | 64.08,71.78 64.08,73.23 C19.1 | 50.22,79.25 51.44,79.25 51.66,79.48 R15.2 | 50.22,79.25 R20.1 | 50.22,79.25 50.22,77.34 52.65,74.91 56.54,74.91 | v69.42,68.12 69.65,67.89 71.17,67.89 IC11.1 | 64.08,71.78 62.23,71.78 59.74,71.78 SV26.1
  Bottom 0.381: C17.2 R19.1 51.82,80.94 R15.2
CAM_VSYNC  (via drill 0.3, 0.38)
  Top 0.152: K1.18 52.35,80.54 52.35,74.45 54.56,72.24 54.56,71.78 SV26.5 54.63,71.7 55.63,70.71 55.63,66.45 58.01,64.06 v58.01,62.84 | v39.32,41.15 43.28,45.11 v44.96,45.11 | v47.8,48.87 47.94,49.01 48.7,49.01 49.76,50.06 49.76,52.2 50.4,52.84 50.73,52.84 51.07,53.18 51.07,53.96 52.81,55.7 52.81,57.68 v52.7,57.78
  Bottom 0.152: IC10.IO25 40.23,36.2 39.55,36.88 39.55,40.92 v39.32,41.15 | v44.96,45.11 47.8,47.95 v47.8,48.87 | 58.01,62.66 v58.01,62.84 57.43,62.26 57.43,62.1 55.6,60.27 55.19,60.27 v52.7,57.78
CHARGE_ON  (via drill 0.3)
  Top 0.152: v37.49,51.56 36.58,52.48 36.58,57.61 v35.74,58.45
  Bottom 0.152: v37.49,51.56 35.64,51.56 34.21,50.14 IC5.36 | v35.74,58.45 34.21,58.45 32.08,60.58 32.08,63.25 28.02,67.31 27.3,67.31 26.44,68.17 26.44,68.88 26.13,69.19 | 26.13,69.19 26.14,69.19 | R8.1 24.46,69.19 26.04,69.19 26.13,69.19
ESP_5V
  Top 0.381: SV25.8 20.34,32.99 22.55,32.99 23.93,31.62 26.92,31.62 27.13,31.62 29.59,31.62 31.33,29.88 31.33,28.02 32.96,26.4 32.96,25.77 33.51,25.21 33.54,25.21 33.57,25.18 33.57,24.75 34.12,24.19 34.45,24.19 36.21,22.44 37.83,22.44 39.01,21.26 41.27,21.26 41.27,20.85 41.85,20.27 42.23,20.27 42.55,19.95 43.6,19.95 43.98,19.57 43.98,19.22 44.37,18.82 44.37,17.68 44.8,17.26 45.52,17.26 45.9,16.88 46.69,16.88 46.8,16.76 50.3,16.76 51.17,15.89 53.58,15.89 54.12,16.43 54.94,16.43 55.15,16.23 60.73,16.23 60.96,16.46 JP2.8
  Bottom 0.381: SV25.8 20.57,32.77 22.17,32.77 C12.1
ESP_AEN  (via drill 0.3, 0.38)
  Top 0.152: v61.34,24.69 61.57,24.69 61.8,24.92 66.22,24.92 v66.75,24.38 | v5.71,33.5 5.71,17.91 v13.49,10.13 | v37.34,6.55 37.34,9.9 37.82,10.38 37.82,13.39 38.34,13.91 38.34,14.21 38.46,14.33 42.6,14.33 42.83,14.1 43.27,14.1 43.81,14.63 44.88,14.63 45.19,14.94 45.19,15.38 44.87,15.7 44.43,15.7 44.2,15.47 43.87,15.47 43.64,15.7 v43.54,15.7 | v42.27,21.26 42.85,20.68 43.9,20.68 44.76,19.82 44.76,19.47 45.1,19.12 45.1,17.98 47.17,17.98 47.67,18.48 48.39,18.48 49.05,17.82 53.07,17.82 53.61,18.35 55.26,18.35 55.86,18.95 v56.41,18.95
  Bottom 0.152: C16.2 14.55,48.39 14.55,47.93 12.8,46.18 R30.2 12.72,46.18 12.72,44.12 R31.1 12.65,44.04 12.65,40.92 10.82,39.09 8.91,39.09 5.71,35.89 v5.71,33.5 | v66.75,24.38 69.49,24.38 70.48,25.38 SV24.6 | IC10.EN 40.69,27.28 41.38,27.28 41.41,27.24 41.41,27.07 41.75,26.73 41.92,26.73 42.27,26.39 v42.27,21.26 42.27,17.21 42.51,16.96 42.51,16.72 v43.54,15.7 | v37.34,6.55 37.03,6.55 35.36,4.88 33.38,4.88 32.38,5.87 16.03,5.87 PAD18.1 | v56.41,18.95 56.41,19.2 56.19,19.43 56.19,20.52 57.92,22.26 58.5,22.26 58.84,22.6 58.84,23.33 60.2,24.69 v61.34,24.69
  Bottom 0.381: v13.49,10.13 13.49,3.33 PAD18.1
ESP_BOOT  (via drill 0.3, 0.38)
  Top 0.152: JP3.6 35.51,21.57 33.07,21.57 SJ12.1 32.99,21.64 32.77,21.64 31.7,22.71 v31.09,22.71 | K1.12 49.23,80.54 49.23,79.93 48.46,79.17 v48.46,78.18 48.46,72.16 48.54,72.08 48.54,71.32 49.61,70.26 51.05,70.26 52.05,69.27 SV26.8 | v61.54,48.79 60.2,50.14 60.2,53.03 59.99,53.24 59.06,53.24 58.66,53.65 57.99,53.65 57.52,54.12 57.52,54.17 57.51,54.19 57.51,54.88 57.52,54.89 57.52,55 61.49,58.98 61.65,58.98 64.54,61.87 64.54,62.32 63.78,63.08 59.36,63.08 59.36,67.51 58.98,67.89 v58.83,67.89 | v20.95,24.38 20.73,24.38 v19.28,22.94 | v3.96,61.04 v3.96,48.62 | v12.27,83.9 12.8,84.43 19.96,84.43 21.79,86.26 24.36,86.26 26.04,84.58 v26.06,84.58 | v57.3,41.99 57.84,42.53 57.84,42.97 57.52,43.28 57.08,43.28 56.77,42.97 56.77,42.65 55.7,41.58 54.18,41.58 54.18,44.63 55.12,45.57 55.86,45.57 56.24,45.19 57.22,45.19 58.06,46.02 61.18,46.02 62.45,47.3 v62.61,47.3 | v63.27,37.74 63.27,37.67 65.71,35.23 65.71,34.62 66.05,34.28 66.66,34.28 69.15,31.79 v70.13,31.79 | SV24.4 72,24.37 72,25.83 72.6,26.43 73.03,26.43 74.05,27.46 74.05,28.37 73.21,29.21 71.12,29.21 v71.12,29.18 | PAD20.1 85.09,2.54 74.3,2.54 69.56,7.28 69.56,10.01 68.45,11.12 68.45,12.54 v68.62,12.7 | v68.83,21.72 68.83,20.83 68.94,20.73 68.94,15.52 v69.85,14.61
  Bottom 0.152: 21.07,24.5 21.41,24.16 29.64,24.16 v31.09,22.71 | 21.07,24.5 17.83,27.74 17.83,30.48 SV25.9 | 48.46,78.41 48.46,79.25 R20.2 | v57.3,41.99 57.53,41.99 58.22,41.3 58.6,41.3 IC10.IO0 58.67,41.22 59.77,41.22 60.12,40.87 60.6,40.87 63.27,38.2 v63.27,37.74 | SV26.8 52.12,69.19 52.73,69.19 54,67.92 58.8,67.92 v58.83,67.89 | v20.95,24.38 21.07,24.5 | v19.28,22.94 19.28,21.57 17.68,19.96 15.09,19.96 8.53,26.52 8,26.52 3.96,30.56 v3.96,48.62 | v3.96,61.04 3.96,61.34 3.58,61.72 3.58,67.06 6.78,70.26 6.78,78.41 v12.27,83.9 | 48.46,78.41 46.48,78.41 46.33,78.56 46.33,79.7 45.95,80.09 39.4,80.09 35.41,84.07 26.57,84.07 v26.06,84.58 | 48.46,78.41 v48.46,78.18 | v62.61,47.3 62.43,47.3 61.89,47.84 61.89,48.45 v61.54,48.79 | v70.13,31.79 69.4,31.06 R44.1 70.17,29.97 70.69,29.45 70.85,29.45 v71.12,29.18 | SV24.4 69.8,22.17 69.75,22.17 69.3,21.72 v68.83,21.72 | v69.85,14.61 69.85,13.93 v68.62,12.7
ESP_IO2  (via drill 0.3, 0.38)
  Top 0.152: v63.32,36.12 63.32,35.97 v64.01,35.28 | 63.02,32.69 v62.94,32.77 61.95,32.77 60.96,31.77 JP2.2 57.2,31.75 56.71,31.26 v55.88,31.26 | SJ18.3 49.2,24.43 v49.53,24.77 | v49.4,28.97 49.4,29.13 49.76,29.49 50.55,29.49 50.86,29.18 50.86,28.87 52.5,27.24 53.4,27.24 53.62,27.46 54.34,27.46 54.87,26.92 v55.12,26.92
  Bottom 0.152: v63.32,36.12 63.83,36.63 63.83,38.1 60.71,41.22 60.2,41.22 59.89,41.53 59.89,41.68 59.05,42.52 58.67,42.52 IC10.IO2 | v64.01,35.28 64.01,33.83 v62.94,32.77 | v49.53,24.77 47.62,26.67 46.87,26.67 45.72,27.82 45.72,28.26 46.12,28.66 48.19,28.66 48.28,28.57 49.01,28.57 v49.4,28.97 | v55.12,26.92 55.22,26.92 55.81,27.52 55.81,28.01 55.47,28.34 55.47,29.88 55.72,30.12 55.72,30.72 55.96,30.96 55.96,31.18 v55.88,31.26
ESP_IO4  (via drill 0.38)
  Top 0.152: v60.94,36.73 60.94,34.59 R24.2 JP2.1 64.77,34.29 64.77,32.38 64.77,32.26 64.77,31.17 65.86,31.17 66.33,30.7 66.33,29.89 66.04,29.6 v66.04,29.21 | v74.5,21.54 74.5,23.73 75.81,25.04 75.81,25.84 77.09,27.13 80.25,27.13 80.59,26.78 80.59,23.82 81.2,23.21 81.2,22.91 80.41,22.7 80,21.99 80.21,21.19 81.34,20.54 81.34,20.4 82.42,19.32 82.42,18.54 v83.18,17.78
  Bottom 0.152: SJ24.2 80.62,9.68 80.62,10.67 80.7,10.74 80.7,10.97 79.68,11.99 79.68,12.63 82.54,15.5 82.54,17.14 v83.18,17.78 | IC10.IO4 59.05,40.01 60.94,38.12 v60.94,36.73 | v74.5,21.54 74.5,21.9 74.05,22.35 74.05,23.29 73.45,23.89 72.6,23.89 72.23,23.52 71.66,23.52 70.96,24.22 70.96,24.47 71.48,24.99 71.48,26.75 71.32,26.9 67.08,26.9 66.04,27.94 v66.04,29.21
ESP_IO12_SCL  (via drill 0.3, 0.38)
  Top 0.152: 60.96,21.64 63.78,21.64 R25.1 63.86,21.57 64.01,21.41 v64.01,20.27 | v46.79,36.2 52.35,30.63 54.86,30.63 v55.14,30.35 | 60.96,21.64 JP2.6 | v44.04,40.84 43.69,41.2 v41.96,41.2 | v57.3,25.55 60.96,21.89 60.96,21.64
  Bottom 0.152: v64.01,20.27 64.01,19.96 64.35,19.62 64.62,19.62 66.07,18.17 66.22,18.17 66.92,17.48 66.92,16.5 66.86,16.45 66.86,16.04 67.36,15.54 67.47,15.54 67.71,15.3 68.18,15.3 68.45,15.57 72.36,15.57 73.3,14.63 73.34,13.47 74.27,11.93 75.03,11.18 76.96,11.18 79.88,14.1 79.88,16.38 80.47,16.84 81.17,16.84 81.43,16.57 81.91,16.57 82.24,16.91 82.24,17.38 81.78,17.84 82.43,18.5 SJ25.1 | v41.96,41.2 40.69,41.22 IC10.IO12 | v46.79,36.2 44.17,38.81 44.17,40.51 v44.04,40.84 | v57.3,25.55 57.3,25.95 56.93,26.31 56.93,26.73 56.66,27 56.66,27.03 56.42,27.27 56.42,28 56.69,28.27 56.69,30.07 56.93,30.32 56.93,31.15 56.6,31.48 56.46,31.48 56.12,31.83 55.3,31.83 54.89,31.42 54.89,30.61 v55.14,30.35
ESP_IO13_SDA  (via drill 0.3, 0.38)
  Top 0.152: v61.19,42.75 61.19,41.76 57.99,38.56 57.3,38.56 56.69,39.17 v56.2,39.17 52.86,39.17 52.79,39.24 52.43,39.24 52.12,39.55 52.12,39.88 51.77,40.23 51.56,40.23 51.33,40.46 50.44,40.46 50.29,40.62 v49.23,40.62 | JP2.5 63.48,24.16 60.74,24.16 57.79,27.1 57.79,27.14 v57.3,27.64 57.3,26.56 56.72,25.99 56.72,25.21 56.83,25.21 57.06,24.98 57.1,24.98 57.65,24.43 57.65,23.05 56.96,22.36 56.96,21.48 55.99,20.51 54.33,20.51 SJ15.1 | v42.67,43.74 46.18,43.74 46.25,43.66 49,43.66 49.07,43.74 49.61,43.74 v50.06,43.28
  Bottom 0.152: v61.19,42.75 60.88,43.05 60.88,44.12 R29.1 | 42.6,43.81 v42.67,43.74 42.7,43.72 43.43,43.72 43.76,43.39 43.76,42.93 43.43,42.6 42.97,42.6 42.67,42.9 42.33,42.9 41.83,43.39 41.83,43.81 IC10.IO13 | v50.06,43.28 50.06,42.9 49.3,42.14 49.3,40.69 v49.23,40.62 | v56.2,39.17 v56.21,39.17 56.46,38.91 56.46,37.45 56.67,37.24 56.67,35.66 57.26,35.07 57.26,31.71 57.3,31.67 57.3,31.64 57.54,31.4 57.54,30.07 57.3,29.82 v57.3,27.64
ESP_IO14  (via drill 0.3, 0.38)
  Top 0.152: v61.34,29.18 63.48,29.18 JP2.3 63.7,29.41 | v59.97,32.77 56.84,32.77 55.91,31.83 55.64,31.83 55.26,31.45 | v51.49,37.44 54.25,34.67 55.32,34.67 55.88,34.11 55.88,33.02 55.42,32.56 52.88,32.56 52.54,32.23 52.54,31.75 52.88,31.42 54.85,31.42 54.87,31.45 55.26,31.45 | v50.97,39.59 47.51,39.59 v47.47,39.62 | SJ17.1 54.95,22.87 55.2,22.87 55.71,22.36 56.53,22.36 57.35,23.18 57.35,24.3 57.01,24.63 56.87,24.63 56.42,25.09 56.42,26.44 v56.36,26.5 | v56.36,30.56 56.23,30.69 55.64,30.69 55.31,31.02 55.31,31.4 55.26,31.45
  Bottom 0.152: v59.97,32.77 59.97,31.17 61.34,29.79 v61.34,29.18 | IC10.IO14 41.55,40.01 43.31,41.76 44.48,41.76 45.03,41.2 47.17,41.2 47.32,41.05 47.32,39.78 v47.47,39.62 | v51.49,37.44 51.49,39.14 51,39.62 v50.97,39.59 | v56.36,26.5 56.36,26.9 56.11,27.15 56.11,30.31 v56.36,30.56
ESP_IO15  (via drill 0.38)
  Top 0.152: JP2.4 60.26,27.37 60.09,27.37 59.7,27.76 57.98,27.76 57.53,28.21 57.06,28.21 56.61,27.76 v55.09,27.76 53.49,27.76 53.27,27.55 52.62,27.55 51.17,29 51.17,29.3 50.66,29.81 v49.28,29.81
  Bottom 0.152: IC10.IO15 57.61,43.81 54.56,40.77 54.56,29.13 54.83,28.86 54.83,28.55 55.09,28.28 v55.09,27.76 | v49.28,29.81 48.44,28.97 46.29,28.97 46.29,29.45 45.96,29.78 45.48,29.78 45.11,29.41 45.11,27.57 46.62,26.06 46.99,26.06 48.12,24.93 48.12,24.5 49.01,23.61 49.01,20.23 SJ16.3
  other vias: 49.25,19.99
ESP_RES
  Bottom 0.152: R31.2 14.63,44.04 14.63,38.79 14.86,38.56 16.46,38.56 16.84,38.18 16.84,37.64 17.98,36.5 19.36,36.5 20.27,35.59 SV25.6
ESP_RXD  (via drill 0.3, 0.35)
  Top 0.127: 21.87,53.87 22.15,53.59 24.05,53.59 v24.16,53.7
  Top 0.152: 67.89,27.96 SV24.7 | v21.79,58.98 v20.65,58.98 19.28,57.61 19.28,56.77 19.89,56.16 20.65,56.16 21.87,54.94 21.87,53.87 | SV25.3 17.83,38.1 18.75,39.01 18.75,41.83 22.4,45.49 22.42,45.49 23.09,46.16 23.09,46.18 24.88,47.97 24.99,47.85 25.27,48.13 26.63,48.13 26.76,48.26 26.76,49.48 v27.2,49.48 | v21.18,36.42 23.09,34.52 24.49,34.52 24.54,34.57 25.81,34.57 26.29,35.05 27.05,35.05 27.53,34.57 28.42,34.57 30.54,32.45 33.69,32.45 33.73,32.49 37.31,32.49 37.44,32.35 37.44,31.35 38.1,30.69 JP3.3 38.1,29.18 40.16,29.18 41.47,27.88 43.7,27.88 43.96,27.61 44.75,27.61 44.85,27.51 v47.24,27.51 | v53.03,30.1 53.19,29.95 54.74,29.95 54.91,29.78 56.15,29.78 56.33,29.96 60.13,29.96 v60.27,30.1 60.66,30.1 61.42,30.86 65.65,30.86 66.03,30.49 66.03,30.02 65.41,29.39 65.41,28.68 65.91,28.18 65.91,28.19 66.16,27.94 SV24.7 | PAD1.1 71.89,27.94 70.89,26.95 70.08,26.95 69.08,27.94 SV24.7 | v25.86,53.37 25.86,52.12 26.14,51.84 26.9,51.84 v27.1,51.64
  Bottom 0.152: v60.27,30.1 60.05,29.87 58.67,29.87 IC10.RXD0 | v20.65,58.98 19.74,59.89 19.74,60.05 SJ19.1 | v21.79,58.98 21.79,59.66 22.17,60.05 SJ21.1 | IC5.25 27.89,48.69 27.74,48.69 27.2,49.23 v27.2,49.48 27.36,49.63 27.36,51.38 v27.1,51.64 | v21.18,36.42 20.8,36.42 20.12,37.11 18.82,37.11 17.83,38.1 SV25.3 | v53.03,30.1 52.12,30.1 50.98,28.96 50.98,28.78 50.97,28.77 50.97,28.11 50.45,27.6 49.79,27.6 49.7,27.51 v47.24,27.51 | v24.16,53.7 24.28,53.57 24.77,53.57 24.97,53.37 v25.86,53.37
ESP_SD0  (via drill 0.3, 0.38)
  Top 0.152: v54.46,17.42 54.57,17.31 54.48,17.2 55.56,17.2 56.12,17.75 59.82,17.75 v60.05,17.98
  Bottom 0.152: v60.05,17.98 61.04,16.99 61.04,10.67 60.66,10.29 60.66,8.31 59.59,7.24 R33.2 | 58.6,46.33 IC10.SD0 58.05,45.76 57.7,45.76 57.56,45.62 57.56,44.8 53.82,41.07 53.82,39.64 53.16,38.98 53.16,38.41 53.24,38.34 53.24,34.23 53.07,34.07 53.07,32.96 53.95,32.08 53.95,28.87 54.22,28.61 54.22,25.74 54.37,25.59 54.37,24.07 54.59,23.86 54.59,19.1 54.38,18.9 54.38,17.35 v54.46,17.42
ESP_SD1  (via drill 0.3, 0.38)
  Top 0.152: v55.02,25.2 55.78,24.43 v55.8,24
  Bottom 0.152: R34.2 57.45,7.09 57.45,7.24 56.24,8.46 56.24,10.29 56.16,10.36 56.16,15.85 57,16.69 57,17.14 56.69,17.45 56.24,17.45 55.5,18.19 55.5,23.65 v55.8,24 | IC10.SD1 58.4,44.84 58.03,44.84 54.25,41.07 54.25,33.61 53.98,33.33 53.98,32.48 54.25,32.21 54.25,29 54.52,28.73 54.52,25.87 54.67,25.71 54.67,25.54 v55.02,25.2
ESP_SDCLK  (via drill 0.3, 0.38)
  Top 0.152: v65.58,33.55 65.08,33.05 65.08,32.05 v65.38,31.75
  Bottom 0.152: IC10.CLK 59.05,47.62 59.74,46.94 59.74,43.43 60.96,42.22 60.96,41.83 64.57,38.23 64.57,34.57 v65.58,33.55 | R32.2 61.72,7.16 61.87,7.16 63.63,5.41 65.46,5.41 67.36,7.32 67.36,8.99 66.14,10.21 66.14,15.24 66.26,15.36 66.26,16.7 66.31,16.76 66.31,17.23 65.97,17.56 65.49,17.56 65.42,17.64 65.42,17.96 64.37,19.01 64.05,19.01 63.17,19.89 63.17,22.71 64.24,23.77 64.24,26.75 64.85,27.36 64.85,29.62 64.58,29.89 64.58,30.72 65.35,31.49 65.38,31.5 v65.38,31.75
ESP_TXD  (via drill 0.3, 0.35, 0.38)
  Top 0.127: 26.42,57.66 26.42,56.64 25.91,56.13 25.91,55.63 26.42,55.12 26.42,52.52 26.75,52.18 | 21.1,47.47 20.27,48.3 20.27,49.51 19.3,50.47 v19.3,50.98 | v16.31,50.72 17.12,51.54 v17.55,51.54
  Top 0.152: v18.82,58.45 18.82,60.27 v18.36,60.73 | v63.7,27.43 64.47,27.43 68.05,23.85 68.36,23.85 69.41,22.8 69.41,21.4 SV24.2 70.48,20.34 | v14.78,31.01 13.56,32.23 13.56,40.77 15.93,43.13 17.91,43.13 19.76,44.99 20.09,45.32 20.1,45.32 20.4,45.62 20.4,45.81 20.73,46.13 20.91,46.13 21.41,46.63 21.41,47.16 21.1,47.47 | v17.22,31.62 17.22,32.23 16.84,32.61 16.84,34.59 17.75,35.51 SV25.5 | v60.33,27.94 60.33,28.35 57.82,28.35 57.66,28.51 56.93,28.51 56.75,28.33 54.31,28.33 54.29,28.35 53.26,28.35 v53.03,28.12 | v50.52,25.86 50.52,25.78 50.38,25.64 49.17,25.64 49.14,25.62 48.33,25.62 48.06,25.35 44.35,25.35 44.32,25.32 40.25,25.32 40.1,25.48 39.29,25.48 35.59,29.18 35.59,31.7 JP3.2 35.51,31.77 30.4,31.77 28.93,33.25 28.93,33.43 28.12,34.24 26.47,34.24 v26.42,34.29 | 26.75,52.18 26.77,52.2 v27.87,52.2 | v25.15,58.42 25.65,58.42 26.42,57.66
  Bottom 0.127: v18.82,58.45 17.2,58.45 16.59,57.84 16.59,54 15.65,53.06 15.65,51.38 v16.31,50.72 | v17.55,51.54 18.75,51.54 v19.3,50.98
  Bottom 0.152: v18.36,60.73 18.36,62.03 19.43,63.09 19.66,63.09 SJ19.3 19.74,63.09 22.17,63.09 SJ21.3 | 60.27,28.57 62.56,28.57 v63.7,27.43 | 60.27,28.57 IC10.TXD0 | SV25.5 17.83,35.51 18.97,35.51 20.42,34.06 26.19,34.06 v26.42,34.29 | v14.78,31.01 16.61,31.01 v17.22,31.62 | IC5.26 28.25,49.18 27.66,49.77 27.66,51.99 v27.87,52.2 | v60.33,27.94 60.27,27.99 60.27,28.57 | v50.52,25.86 52.11,27.45 52.11,27.98 52.25,28.12 v53.03,28.12 | v18.82,58.45 18.82,57.23 19.89,56.16 23.72,56.16 24.13,56.57 24.13,57.4 v25.15,58.42
ESP_U3.3  (via drill 0.38)  (2 unrouted)
  Top 0.381: 15.62,34.06 15.62,31.55 15.77,31.39 15.77,27.66 16.84,26.59 16.84,25.91 17.68,25.07 21.26,25.07 23.01,23.32 23.01,19.81 24.28,18.54 28.29,18.54 29.4,19.65 31.42,19.65 34.53,16.54 35.51,16.54 | 15.62,34.06 v15.62,40.77 | 35.51,16.54 35.2,16.84 | 35.51,16.54 JP3.8 35.74,16.54 36.58,17.37 v37.72,17.37 | v91.36,69.34 91.36,63.4 94.26,60.5 v94.26,48.46 | v81.23,3.66 80.85,3.66 75.16,9.35 74.52,9.35 74.12,9.75 74.12,10.32 74.42,10.62 74.42,11.68 73.79,12.32 73.79,12.83 73.28,13.34 73.03,15.62 75.74,18.34 v75.74,20.73 | v8.61,35.43 8.61,35.81 7.16,37.26 7.16,47.55 5.11,49.61 v5.11,69.88 | v5.11,78.94 5.11,82.37 4.04,83.44 4.04,84.2 9.53,89.69 v22.25,89.69 | v77.27,86.56 80.24,86.56 81.61,85.19 83.21,85.19 85.47,82.93 85.47,78.67 85.42,78.61 85.42,75.74 v85.57,75.59 | v15.32,34.06 15.62,34.06 | v60.96,76.83 60.96,76.18 61.63,75.51 62.2,75.51 62.84,74.87 65.27,74.87 67.25,72.89 71.8,72.89 72.91,71.78 80.62,71.78 v81.76,72.92